# EAGLE design IR_hub (EAGLE 6.2)
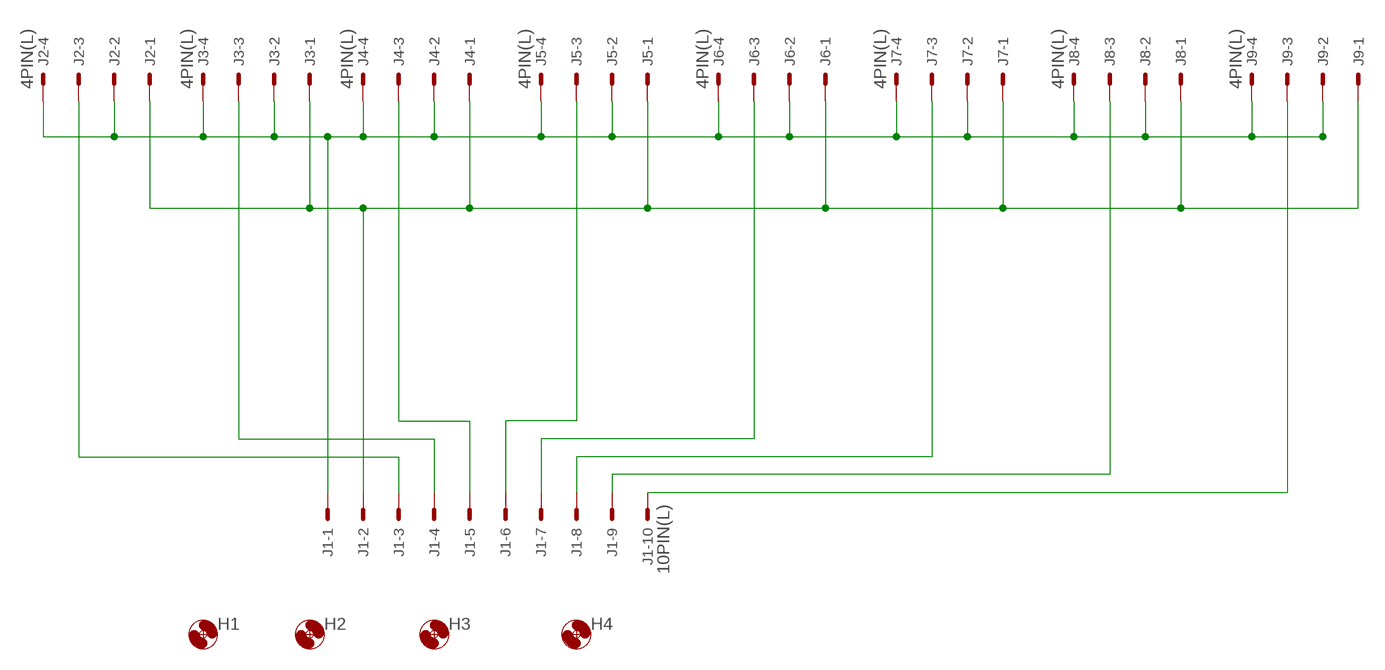
[diagram p0: schematic, sheet 1]

## Parts
H1  HOLE3.3M3BOLT  [HOLE3.3]
H2  HOLE3.3M3BOLT  [HOLE3.3]
H3  HOLE3.3M3BOLT  [HOLE3.3]
H4  HOLE3.3M3BOLT  [HOLE3.3]
J1  10PIN(L)  [10PL]
J2  4PIN(L)  [4PL]
J3  4PIN(L)  [4PL]
J4  4PIN(L)  [4PL]
J5  4PIN(L)  [4PL]
J6  4PIN(L)  [4PL]
J7  4PIN(L)  [4PL]
J8  4PIN(L)  [4PL]
J9  4PIN(L)  [4PL]

## Nets
N$1: J1.10 J9.3
N$2: J1.9 J8.3
N$3: J1.8 J7.3
N$4: J1.7 J6.3
N$5: J1.6 J5.3
N$6: J1.5 J4.3
N$7: J1.4 J3.3
N$8: J1.3 J2.3
N$9: J1.1 J2.2 J2.4 J3.2 J3.4 J4.2 J4.4 J5.2 J5.4 J6.2 J6.4 J7.2 J7.4 J8.2 J8.4 J9.2 J9.4
N$10: J1.2 J2.1 J3.1 J4.1 J5.1 J6.1 J7.1 J8.1 J9.1

## Library data of the parts
H1-H4 = FP-21T for MITS:HOLE3.3
J1 = my_connector:10PIN(L)
J2-J9 = my_connector:4PIN(L)

## Board
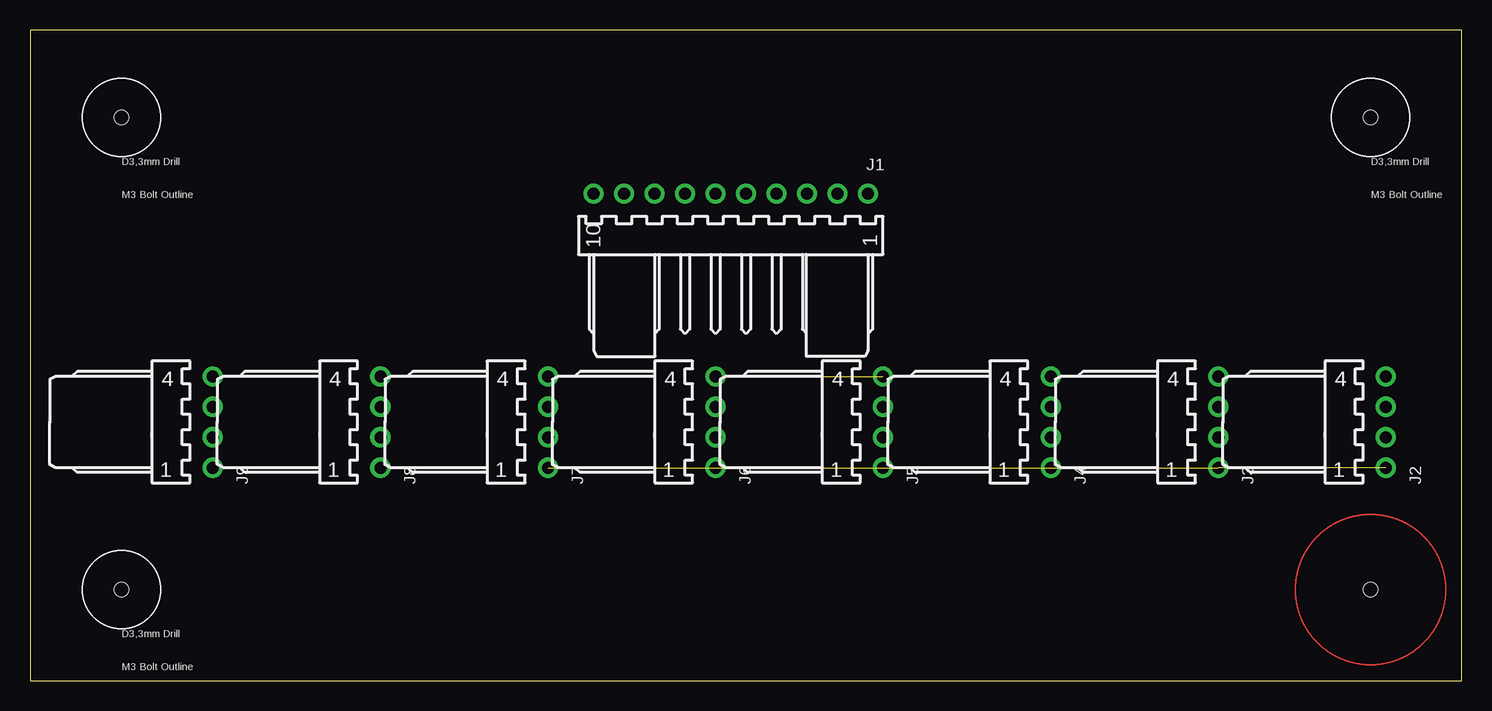
[diagram p1: board, top side]
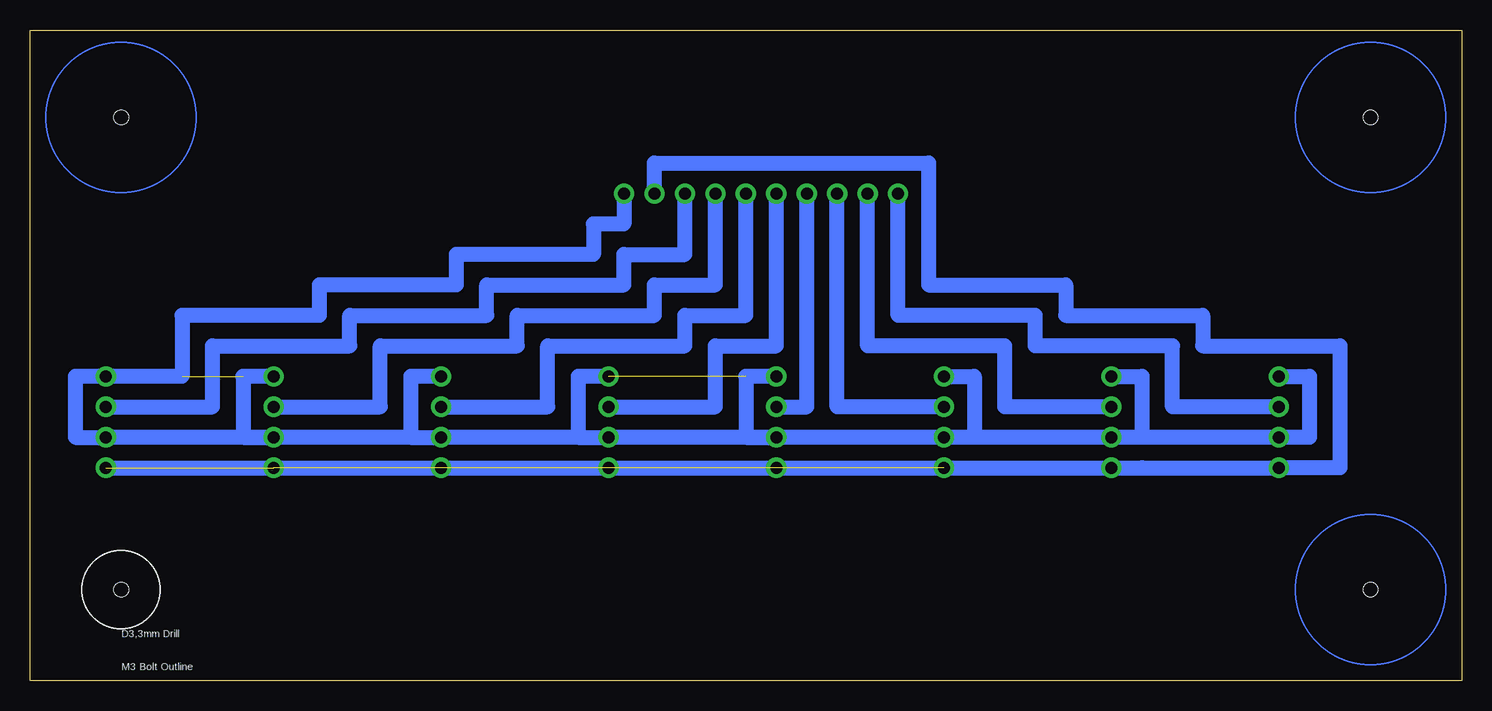
[diagram p2: board, bottom side, seen from below]

Size 119.36 x 54.28 mm. Coordinates in mm from the lower left corner, seen from the top.
Outline: 0,0 119.36,0 119.36,54.28 0,54.28 0,0
Copper layers (1*16): Top 0.035mm / dielectric 1.5mm / Bottom 0.035mm
Design rules: minimum track width 10mil, minimum drill 24mil, track to track 8mil, track to pad 8mil, pad to pad 8mil, via to via 8mil, smd to smd 8mil, copper to edge 40mil, drill to drill 8mil, minimum pad ring 10mil, minimum via ring 8mil, stop-mask expansion 4mil, vias tented up to drill 0mil, thermal gap 10mil

### Footprints (pad centres in the part's own frame; a part is rotated, then mirrored left to right if it is on the bottom)
HOLE3.3 = hole 1.2: 0,0
10PL = drill 1 pad 1.676: 1 11.43,3.81; 2 8.89,3.81; 3 6.35,3.81; 4 3.81,3.81; 5 1.27,3.81; 6 -1.27,3.81; 7 -3.81,3.81; 8 -6.35,3.81; 9 -8.89,3.81; 10 -11.43,3.81
4PL = drill 1 pad 1.676: 1 3.81,3.81; 2 1.27,3.81; 3 -1.27,3.81; 4 -3.81,3.81

### Placement (x,y rotation side)
H1  7.62,46.99 0 top
H2  111.76,7.62 0 bottom
H3  111.76,46.99 0 top
H4  7.62,7.62 0 top
J1  58.42,36.83 0 top
J2  109.22,21.59 270 top
J3  95.25,21.59 270 top
J4  81.28,21.59 270 top
J5  67.31,21.59 270 top
J6  53.34,21.59 270 top
J7  39.37,21.59 270 top
J8  25.4,21.59 270 top
J9  11.43,21.59 270 top

### Tracks (layer width: path | path; a pad name or v marks a point on that pad's centre or on a via)
N$1
  Bottom 1.27: J9.3 24.13,22.86 24.13,27.94 35.56,27.94 35.56,30.48 46.99,30.48 J1.10
N$2
  Bottom 1.27: J8.3 38.1,22.86 38.1,27.94 49.53,27.94 J1.9
N$3
  Bottom 1.27: J7.3 52.07,22.86 J1.8
N$4
  Bottom 1.27: J6.3 54.61,22.86 J1.7
N$5
  Bottom 1.27: J5.3 62.23,22.86 62.23,27.94 57.15,27.94 J1.6
N$6
  Bottom 1.27: J4.3 76.2,22.86 76.2,27.94 64.77,27.94 64.77,30.48 59.69,30.48 J1.5
N$7
  Bottom 1.27: J3.3 90.17,22.86 90.17,27.94 78.74,27.94 78.74,30.48 67.31,30.48 67.31,33.02 62.23,33.02 J1.4
N$8
  Bottom 1.27: J2.3 104.14,22.86 104.14,27.94 92.71,27.94 92.71,30.48 81.28,30.48 81.28,33.02 69.85,33.02 69.85,35.56 64.77,35.56 J1.3
N$9  (2 unrouted)
  Bottom 1.27: J7.4 40.64,25.4 40.64,20.32 J7.2 | J8.4 26.67,25.4 26.67,20.32 J8.2 | J9.4 12.7,25.4 12.7,20.32 J9.2 J8.2 | J6.4 59.69,25.4 59.69,20.32 J6.2 | 73.66,20.32 J5.2 J7.2 | 87.63,20.32 J4.2 73.66,20.32 | J3.4 101.6,25.4 101.6,20.32 J3.2 | J8.2 J7.2 | 87.63,20.32 J2.2 115.57,20.32 115.57,25.4 J2.4 106.68,25.4 106.68,30.48 95.25,30.48 95.25,33.02 83.82,33.02 83.82,35.56 72.39,35.56 72.39,38.1 69.85,38.1 J1.1 | J5.4 73.66,25.4 73.66,20.32 | J4.4 87.63,25.4 87.63,20.32
N$10  (5 unrouted)
  Bottom 1.27: J2.1 J8.1 26.67,17.78 J9.1 10.16,17.78 10.16,27.94 21.59,27.94 21.59,30.48 33.02,30.48 33.02,33.02 44.45,33.02 44.45,43.18 67.31,43.18 J1.2